# Altium schematic sheet Flow_sensors.SchDoc
size A; SheetNumber: 7; SheetTotal: 7
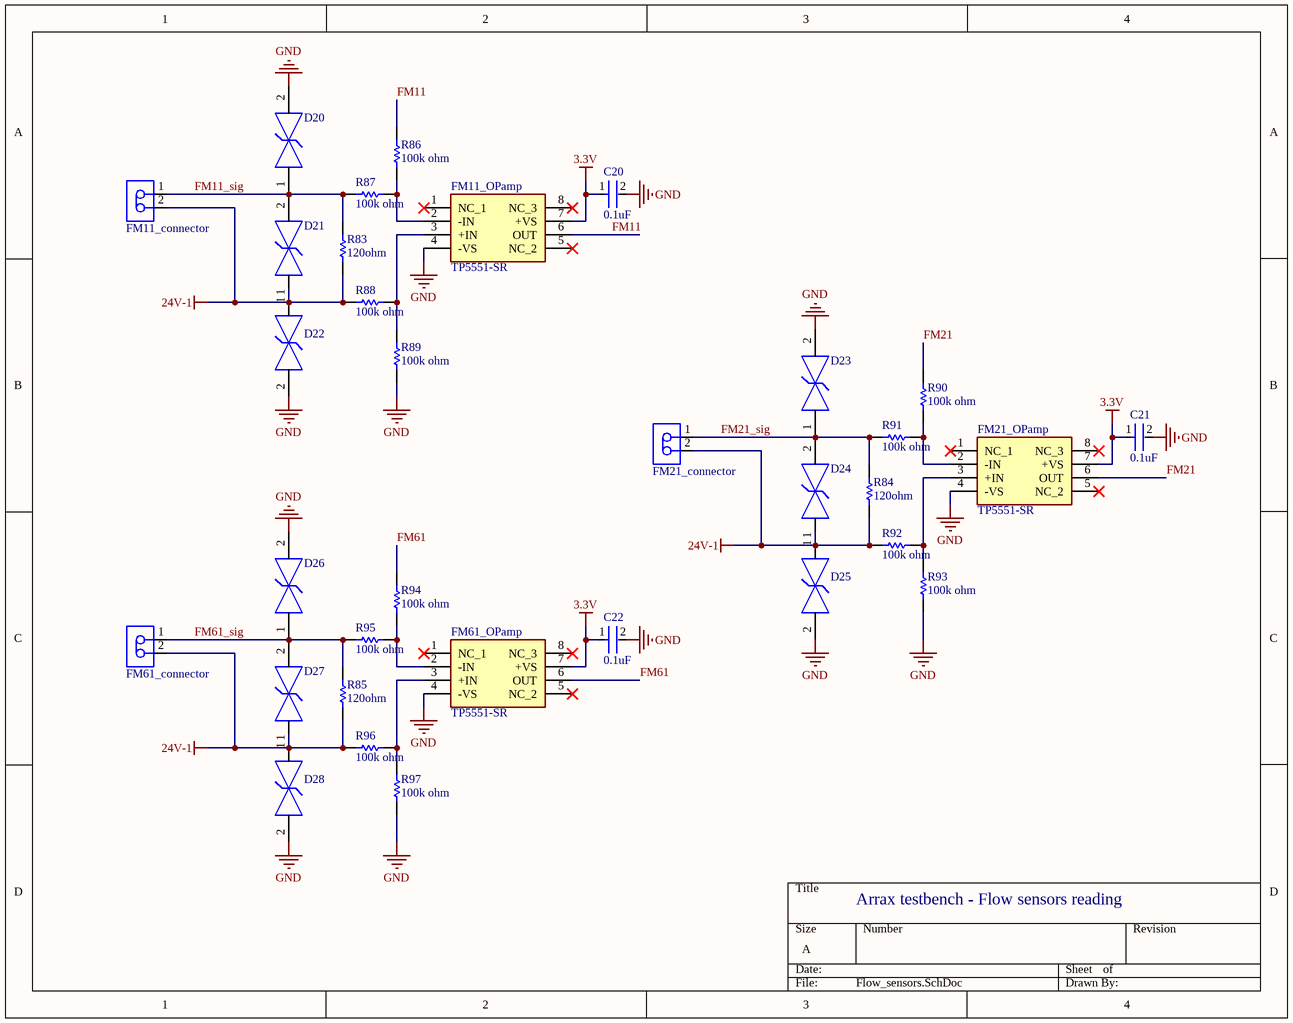
[diagram p0: Flow_sensors.SchDoc]

## Parts
C20  0.1uF  [FP-CC0805-0_85-MFG]
C21  0.1uF  [FP-CC0805-0_85-MFG]
C22  0.1uF  [FP-CC0805-0_85-MFG]
D20  SMBJ33CA-13-F  [FP-SMB-CA-MFG]  (value not drawn)
D21  SMBJ33CA-13-F  [FP-SMB-CA-MFG]  (value not drawn)
D22  SMBJ33CA-13-F  [FP-SMB-CA-MFG]  (value not drawn)
D23  SMBJ33CA-13-F  [FP-SMB-CA-MFG]  (value not drawn)
D24  SMBJ33CA-13-F  [FP-SMB-CA-MFG]  (value not drawn)
D25  SMBJ33CA-13-F  [FP-SMB-CA-MFG]  (value not drawn)
D26  SMBJ33CA-13-F  [FP-SMB-CA-MFG]  (value not drawn)
D27  SMBJ33CA-13-F  [FP-SMB-CA-MFG]  (value not drawn)
D28  SMBJ33CA-13-F  [FP-SMB-CA-MFG]  (value not drawn)
FM11_connector  640456-2  [TECO-640456-2_V]  (value not drawn)
FM11_OPamp  TP5551-SR  [SOIC127P600X175-8N]
FM21_connector  640456-2  [TECO-640456-2_V]  (value not drawn)
FM21_OPamp  TP5551-SR  [SOIC127P600X175-8N]
FM61_connector  640456-2  [TECO-640456-2_V]  (value not drawn)
FM61_OPamp  TP5551-SR  [SOIC127P600X175-8N]
R83  120ohm  [RESC2013X60X40ML20T25]
R84  120ohm  [RESC2013X60X40ML20T25]
R85  120ohm  [RESC2013X60X40ML20T25]
R86  100k ohm  [RESC2013X70X40ML20T20]
R87  100k ohm  [RESC2013X70X40ML20T20]
R88  100k ohm  [RESC2013X70X40ML20T20]
R89  100k ohm  [RESC2013X70X40ML20T20]
R90  100k ohm  [RESC2013X70X40ML20T20]
R91  100k ohm  [RESC2013X70X40ML20T20]
R92  100k ohm  [RESC2013X70X40ML20T20]
R93  100k ohm  [RESC2013X70X40ML20T20]
R94  100k ohm  [RESC2013X70X40ML20T20]
R95  100k ohm  [RESC2013X70X40ML20T20]
R96  100k ohm  [RESC2013X70X40ML20T20]
R97  100k ohm  [RESC2013X70X40ML20T20]

## Nets
3.3V: C20.1 C21.1 C22.1 FM11_OPamp.7(+VS) FM21_OPamp.7(+VS) FM61_OPamp.7(+VS)
24V-1: D21.1 D22.1 D24.1 D25.1 D27.1 D28.1 FM11_connector.2 FM21_connector.2 FM61_connector.2 R83.1 R84.1 R85.1 R88.2 R92.2 R96.1
GND: C20.2 C21.2 C22.2 D20.2 D22.2 D23.2 D25.2 D26.2 D28.2 FM11_OPamp.4(-VS) FM21_OPamp.4(-VS) FM61_OPamp.4(-VS) R89.1 R93.1 R97.1
FM11: FM11_OPamp.6(OUT) R86.2
FM11_sig: D20.1 D21.2 FM11_connector.1 R83.2 R87.2
FM21: FM21_OPamp.6(OUT) R90.2
FM21_sig: D23.1 D24.2 FM21_connector.1 R84.2 R91.2
FM61: FM61_OPamp.6(OUT) R94.2
FM61_sig: D26.1 D27.2 FM61_connector.1 R85.2 R95.1
NetFM11_OPamp_2: FM11_OPamp.2(-IN) R86.1 R87.1
NetFM11_OPamp_3: FM11_OPamp.3(+IN) R88.1 R89.2
NetFM21_OPamp_2: FM21_OPamp.2(-IN) R90.1 R91.1
NetFM21_OPamp_3: FM21_OPamp.3(+IN) R92.1 R93.2
NetFM61_OPamp_2: FM61_OPamp.2(-IN) R94.1 R95.2
NetFM61_OPamp_3: FM61_OPamp.3(+IN) R96.2 R97.2

Not connected (* = marked no-connect by the designer): FM11_OPamp 1(NC_1)* 5(NC_2)* 8(NC_3)*; FM21_OPamp 1(NC_1)* 5(NC_2)* 8(NC_3)*; FM61_OPamp 1(NC_1)* 5(NC_2)* 8(NC_3)*

## Notes on the sheet
- Arrax testbench - Flow sensors reading

## Library data of the parts
C20-C22 = CMP-2100-03606-3: CAP CER 0.1UF 50V X7R 0805; Manufacturer Part Number: CC0805KRX7R9BB104; Manufacturer: Yageo; Tolerance: 0.1; Capacitance: 100 nF; Value: 100 nF; Material: Ceramic; Device Class L1: Passive Components; ComponentLink2Description: Datasheet; Package: CC0805-0.85; Digikey Description: CAP CER 0.1UF 50V X7R 0805; Device Class L3: Ceramic Capacitors; Temperature: -30°C to +85°C; Temperature Characteristic: X7R; Voltage Rating: 50 V; Height: 0.95mm; RoHS: TRUE; Ipc Land Pattern Name: CAPC200125X85; Device Class L2: Capacitors; Category: Cap; Temperature Range Low: -30°C; Temperature Range High: +85°C; Mouser Description: Multilayer Ceramic Capacitors MLCC - SMD/SMT 100nF 50V X7R 10%; Footprint Url: http://www.yageo.com/exep/pages/download/literatures/UPY-C_GEN_24.pdf; Automotive: No; Octopart: https://octopart.com/cc0805krx7r9bb104-yageo-192993; Lead Free: Yes; ComponentLink2URL: http://www.yageo.com/documents/recent/UPY-GPHC_Y5V_6.3V-to-50V_8.pdf
D20-D28 = CMP-12828-000022-1: TVS DIODE 33V 53.3V SMB; Leakage Current: 5uA; ESD Protection: No; Element Configuration: Single; Direction: Bidirectional; Power Dissipation: 600W; Number of Elements: 1; Reverse Breakdown Voltage: 36.7V; Max Breakdown Voltage: 42.2V; Peak Pulse Current: 11.3A; Test Current: 1mA; Capacitance: 800pF; Case/Package: SMB; Contact Plating: Tin; Termination: SMD/SMT; Height: 2.62mm; Power Line Protection: No; Width: 3.9mm; Polarity: Bidirectional; Working Voltage: 33V; Packaging: Tape and Reel; Max Power Dissipation: 600W; Mount: Surface Mount; Min Operating Temperature: -55°C; Breakdown Voltage: 42.2V; Lead Free: Lead Free; Peak Pulse Power: 600W; Voltage Rating (DC): 33V; Max Reverse Leakage Current: 5uA; Max Output Current: 11.3A; Max Operating Temperature: 150°C; Package Quantity: 3000; Radiation Hardening: No; Number of Bidirectional Channels: 1; Min Breakdown Voltage: 36.7V; Length: 4.57mm; Clamping Voltage: 53.3V; Number of Pins: 2; Reverse Standoff Voltage: 33V; Max Surge Current: 11.3A; Composition: Zener
FM11_connector FM21_connector FM61_connector = CMP-2000-05417-1: Male Header, Pitch 2.54 mm, 1 x 2 Position, Height 10.49 mm, Tail Length 3.556 mm, -55 to 105 degC, RoHS, Bulk; Manufacturer: TE Connectivity; Standards: RoHSCompliant,ELVCompliant,UL94V-0; Material, Housing: Polyester; Agency Approvals: CSA,UL; Brand/Series: MTA-100Series; Contact Centerline Spacing: 0.100 / in.; Material, Contact: CopperAlloy; Current, Rating: 5 / A; Color, Housing: White; Contact Termination Area Plating: Tin; Special Features: Pinstrip; Number of Positions: 2; Pin Spacing: 0.1 / "; Temperature, Operating: -55to+105 / degC; Angle: Straight; Mount Angle: Vertical; Connector Type: MTA-100; Primary Type: InterconnectSystem; Voltage, Rating: 250 / V; Mounting Hole Size: 0.04 / "; Number of Rows: 1; Termination: Solder; Length, Terminal Post: 0.14 / in.; Manufacturer URL: http://www.te.com/; Color: White; Size, Post: 0.025 / in.; Contact Shape: Square; Mounting Type: PCMount; Datasheet URL: https://datasheet.ciiva.com/11746/0900766b80eb7fdd-11746365.pdf; Type: PCBPlug; Datasheet Version: Rev. W, 06/2004; Number of Contacts: 2; Flammability Rating: UL94V-0; Contact Plating: Tin; Length, Pin: 0.14 / "; Contact Mating Area Plating: Tin; Length, Overall: 0.2 / "
FM11_OPamp FM21_OPamp FM61_OPamp = TP5551-SR: Integrated Circuit; Manufacturer_Name: 3Peak Incorporated; Datasheet Link: http://file.3peakic.com.cn:8080/product/Datasheet_TP5551-TP5552-TP5554.pdf; Height: 1.75mm; Manufacturer_Part_Number: TP5551-SR
R83-R85 = CMP-2001-00588-1: Manufacturer: Panasonic; Part Number: ERA6AEB121V
R86-R97 = CMP-2001-04377-1: Part Number: ERJ-6ENF1003V; Manufacturer: Panasonic